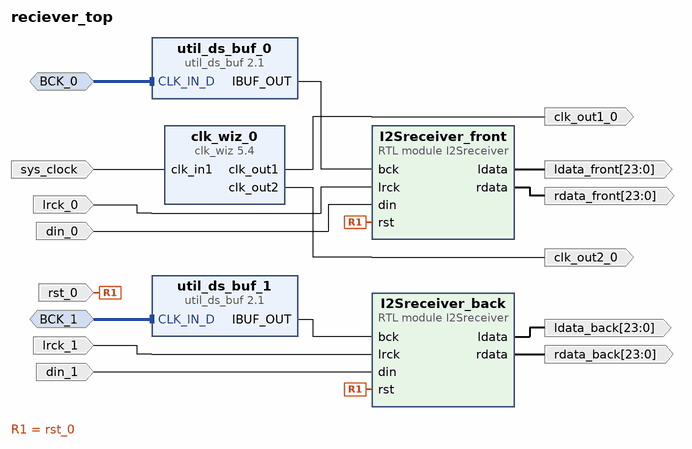
[diagram p0: block diagram of the top level]
# Vivado block design reciever_top, xc7a35tcpg236-1, Vivado 2017.4
create_bd_design reciever_top

create_bd_intf_port -mode Slave -vlnv xilinx.com:interface:diff_clock_rtl:1.0 BCK_0
create_bd_intf_port -mode Slave -vlnv xilinx.com:interface:diff_clock_rtl:1.0 BCK_1
create_bd_port -dir I -type clk sys_clock
set_property -dict {CONFIG.FREQ_HZ 100000000 CONFIG.PHASE 0.000} [get_bd_ports sys_clock]
create_bd_port -dir O -type clk clk_out1_0
set_property -dict {CONFIG.FREQ_HZ 24568965} [get_bd_ports clk_out1_0]
create_bd_port -dir O -type clk clk_out2_0
set_property -dict {CONFIG.FREQ_HZ 24568965} [get_bd_ports clk_out2_0]
create_bd_port -dir I lrck_0
create_bd_port -dir I din_0
create_bd_port -dir I lrck_1
create_bd_port -dir I din_1
create_bd_port -dir I -type rst rst_0
create_bd_port -dir O -from 23 -to 0 ldata_front
create_bd_port -dir O -from 23 -to 0 rdata_front
create_bd_port -dir O -from 23 -to 0 ldata_back
create_bd_port -dir O -from 23 -to 0 rdata_back

create_bd_cell -type ip -vlnv xilinx.com:ip:clk_wiz:5.4 clk_wiz_0
set_property -dict [list \
  CONFIG.CLKOUT2_USED true \
  CONFIG.NUM_OUT_CLKS 2 \
  CONFIG.CLKOUT1_REQUESTED_OUT_FREQ 24.576 \
  CONFIG.CLKOUT2_REQUESTED_OUT_FREQ 24.576 \
  CONFIG.MMCM_DIVCLK_DIVIDE 1 \
  CONFIG.MMCM_CLKFBOUT_MULT_F 7.125 \
  CONFIG.MMCM_CLKOUT0_DIVIDE_F 29.000 \
  CONFIG.MMCM_CLKOUT1_DIVIDE 29 \
  CONFIG.USE_BOARD_FLOW true \
  CONFIG.CLK_IN1_BOARD_INTERFACE sys_clock \
  CONFIG.CLK_IN2_BOARD_INTERFACE Custom \
  CONFIG.RESET_BOARD_INTERFACE reset \
  CONFIG.CLKOUT1_JITTER 196.585 \
  CONFIG.CLKOUT1_PHASE_ERROR 120.953 \
  CONFIG.CLKOUT2_JITTER 196.585 \
  CONFIG.CLKOUT2_PHASE_ERROR 120.953 \
] [get_bd_cells clk_wiz_0]
create_bd_cell -type ip -vlnv xilinx.com:ip:util_ds_buf:2.1 util_ds_buf_0
create_bd_cell -type ip -vlnv xilinx.com:ip:util_ds_buf:2.1 util_ds_buf_1
create_bd_cell -type module -reference I2Sreceiver I2Sreceiver_front
create_bd_cell -type module -reference I2Sreceiver I2Sreceiver_back

# ---- connections ----

connect_bd_intf_net -intf_net CLK_IN_D_0_1 [get_bd_intf_ports BCK_0] [get_bd_intf_pins util_ds_buf_0/CLK_IN_D]
connect_bd_intf_net -intf_net CLK_IN_D_1_1 [get_bd_intf_ports BCK_1] [get_bd_intf_pins util_ds_buf_1/CLK_IN_D]
connect_bd_net [get_bd_ports sys_clock] [get_bd_pins clk_wiz_0/clk_in1]
connect_bd_net [get_bd_pins clk_wiz_0/clk_out1] [get_bd_ports clk_out1_0]
connect_bd_net [get_bd_pins clk_wiz_0/clk_out2] [get_bd_ports clk_out2_0]
connect_bd_net -net lrck_0_1 [get_bd_ports lrck_0] [get_bd_pins I2Sreceiver_front/lrck]
connect_bd_net -net din_0_1 [get_bd_ports din_0] [get_bd_pins I2Sreceiver_front/din]
connect_bd_net -net lrck_1_1 [get_bd_ports lrck_1] [get_bd_pins I2Sreceiver_back/lrck]
connect_bd_net -net din_1_1 [get_bd_ports din_1] [get_bd_pins I2Sreceiver_back/din]
connect_bd_net [get_bd_pins util_ds_buf_0/IBUF_OUT] [get_bd_pins I2Sreceiver_front/bck]
connect_bd_net [get_bd_pins util_ds_buf_1/IBUF_OUT] [get_bd_pins I2Sreceiver_back/bck]
connect_bd_net -net rst_0_1 [get_bd_ports rst_0] [get_bd_pins I2Sreceiver_front/rst] [get_bd_pins I2Sreceiver_back/rst]
connect_bd_net -net I2Sreceiver_0_ldata [get_bd_pins I2Sreceiver_front/ldata] [get_bd_ports ldata_front]
connect_bd_net -net I2Sreceiver_0_rdata [get_bd_pins I2Sreceiver_front/rdata] [get_bd_ports rdata_front]
connect_bd_net -net I2Sreceiver_1_ldata [get_bd_pins I2Sreceiver_back/ldata] [get_bd_ports ldata_back]
connect_bd_net -net I2Sreceiver_1_rdata [get_bd_pins I2Sreceiver_back/rdata] [get_bd_ports rdata_back]

validate_bd_design
save_bd_design
